# EAGLE schematic brakelight (EAGLE 9.2.2)
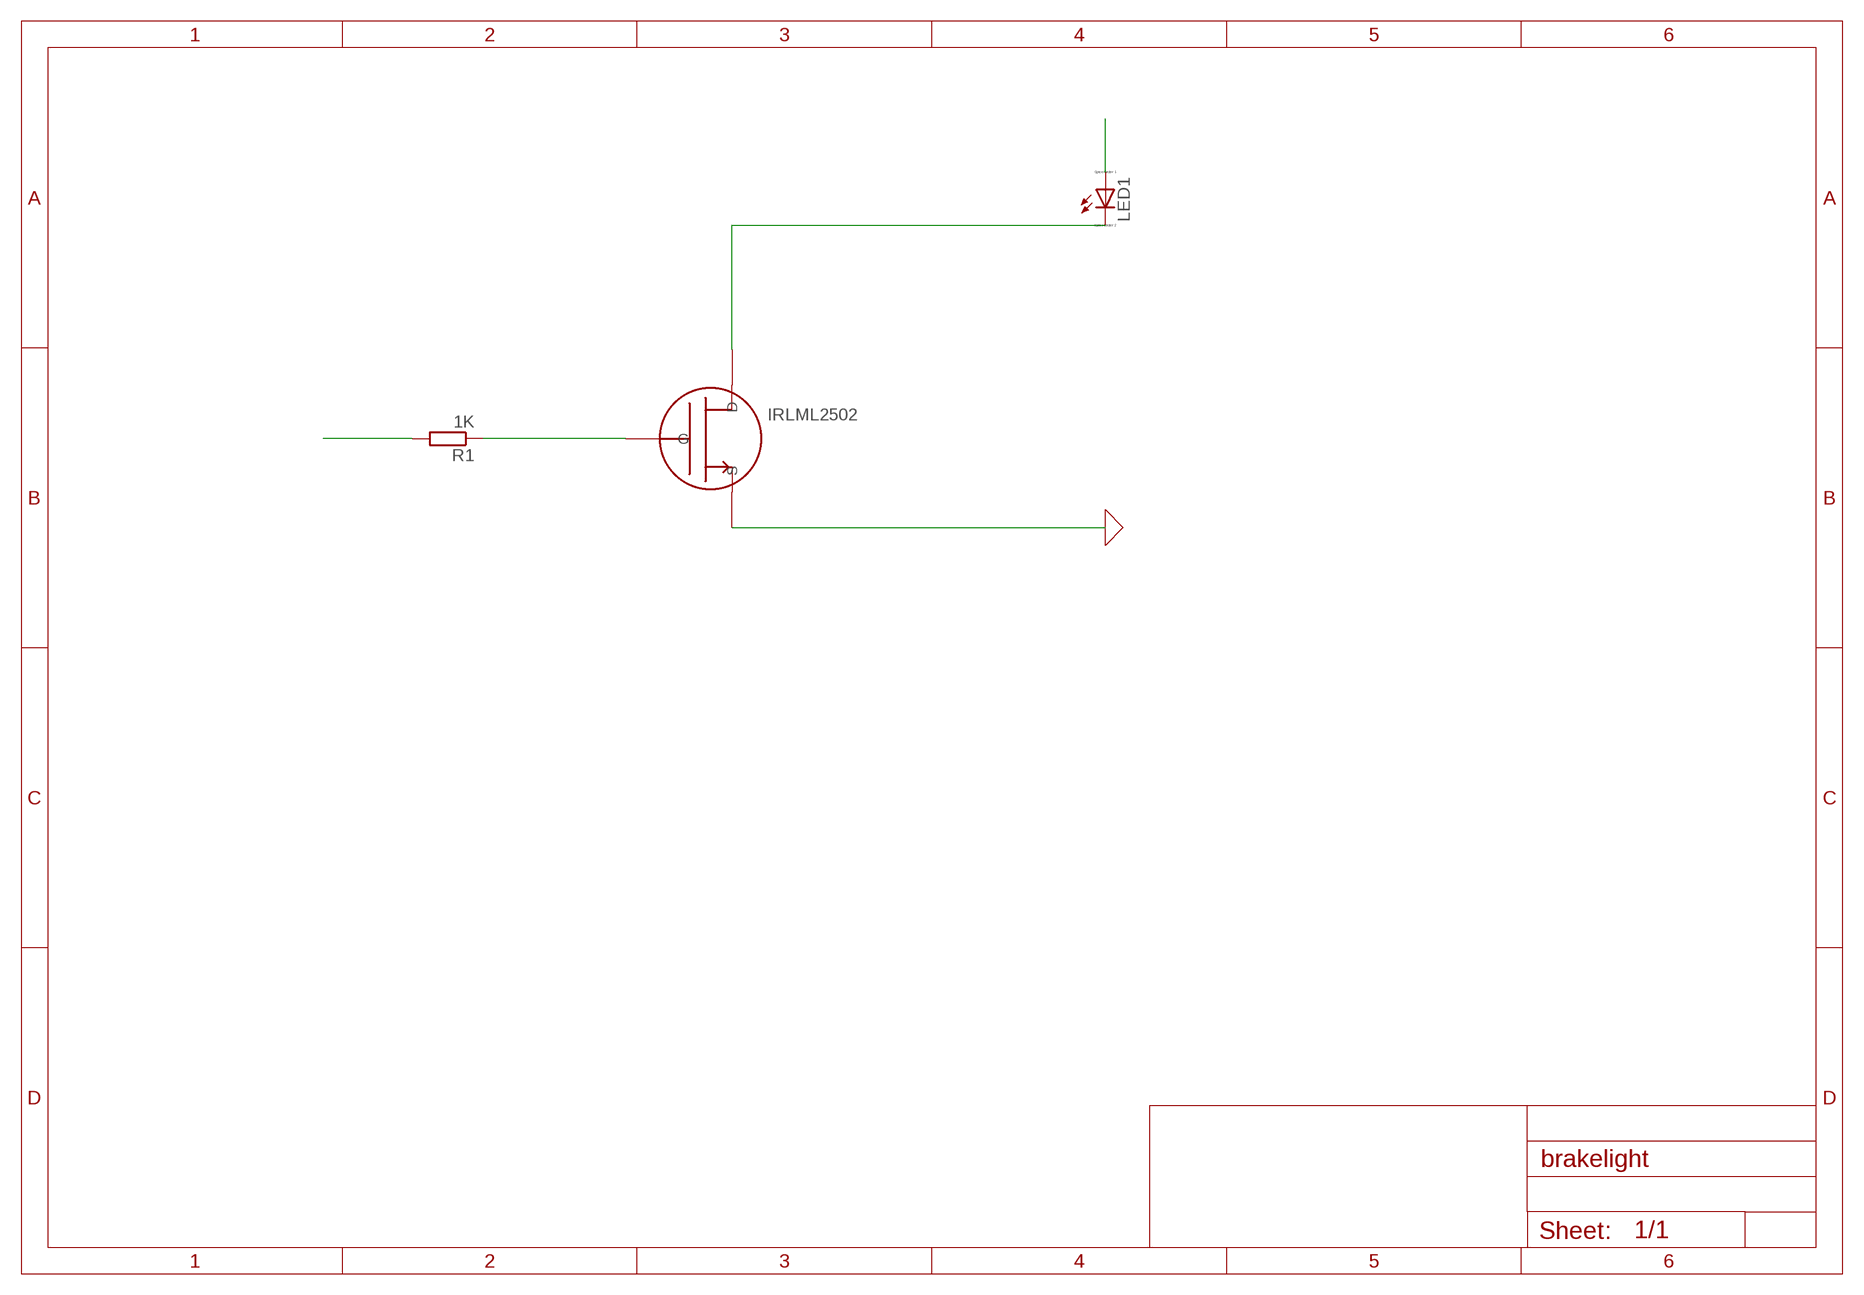
[diagram p0: schematic, sheet 1]

## Parts
IRLML2502  FET_N  (no package)
LED1  LED_ELD260  [LED_LD260]
R1  1K  R-EU_0207/15  [0207/15]

## Nets
N$1: IRLML2502.G R1.1
N$2: IRLML2502.S ; supply symbol labelled GND
N$3: IRLML2502.D LED1.K(C)
N$4: R1.2
N$5: LED1.A

## Library data of the parts
IRLML2502 = ngspice-simulation:FET_N: N-Type MOS Field Effect Transistor (MOSFET)
LED1 = eagle-ltspice:LED_E: LED Source: http://www.osram.convergy.de Source: www.luxeon.com Source: www.kingbright.com; SPICEMODEL: NONE; SPICEPREFIX: D; SPICETYPE: diode
R1 = rcl:R-EU_: RESISTOR, European symbol; SPICEPREFIX: R